# Altium schematic sheet MOD_BOTONES.SchDoc
size A4
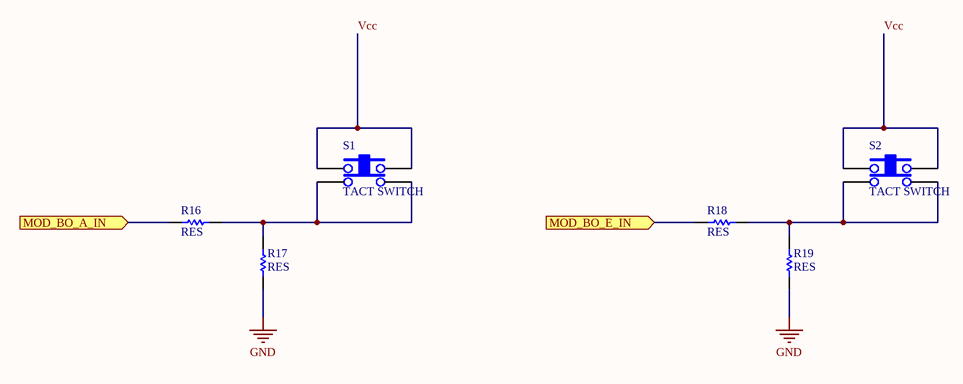
[diagram p0: MOD_BOTONES.SchDoc]

## Parts
R16  RES  [0805]
R17  RES  [0805]
R18  RES  [0805]
R19  RES  [0805]
S1  TACT SWITCH  [TACTSWITCH]
S2  TACT SWITCH  [TACTSWITCH]

## Ports
MOD_BO_A_IN (in), MOD_BO_E_IN (in)

## Nets
GND: R17.1 R19.1
MOD_BO_A_IN: R16.1 ; port MOD_BO_A_IN
MOD_BO_E_IN: R18.1 ; port MOD_BO_E_IN
Vcc: S1.1 S1.3 S2.1 S2.3
NetR16_2: R16.2 R17.2 S1.2 S1.4
NetR18_2: R18.2 R19.2 S2.2 S2.4